# EAGLE design ImageProc2_ver_24d (EAGLE 5.11)
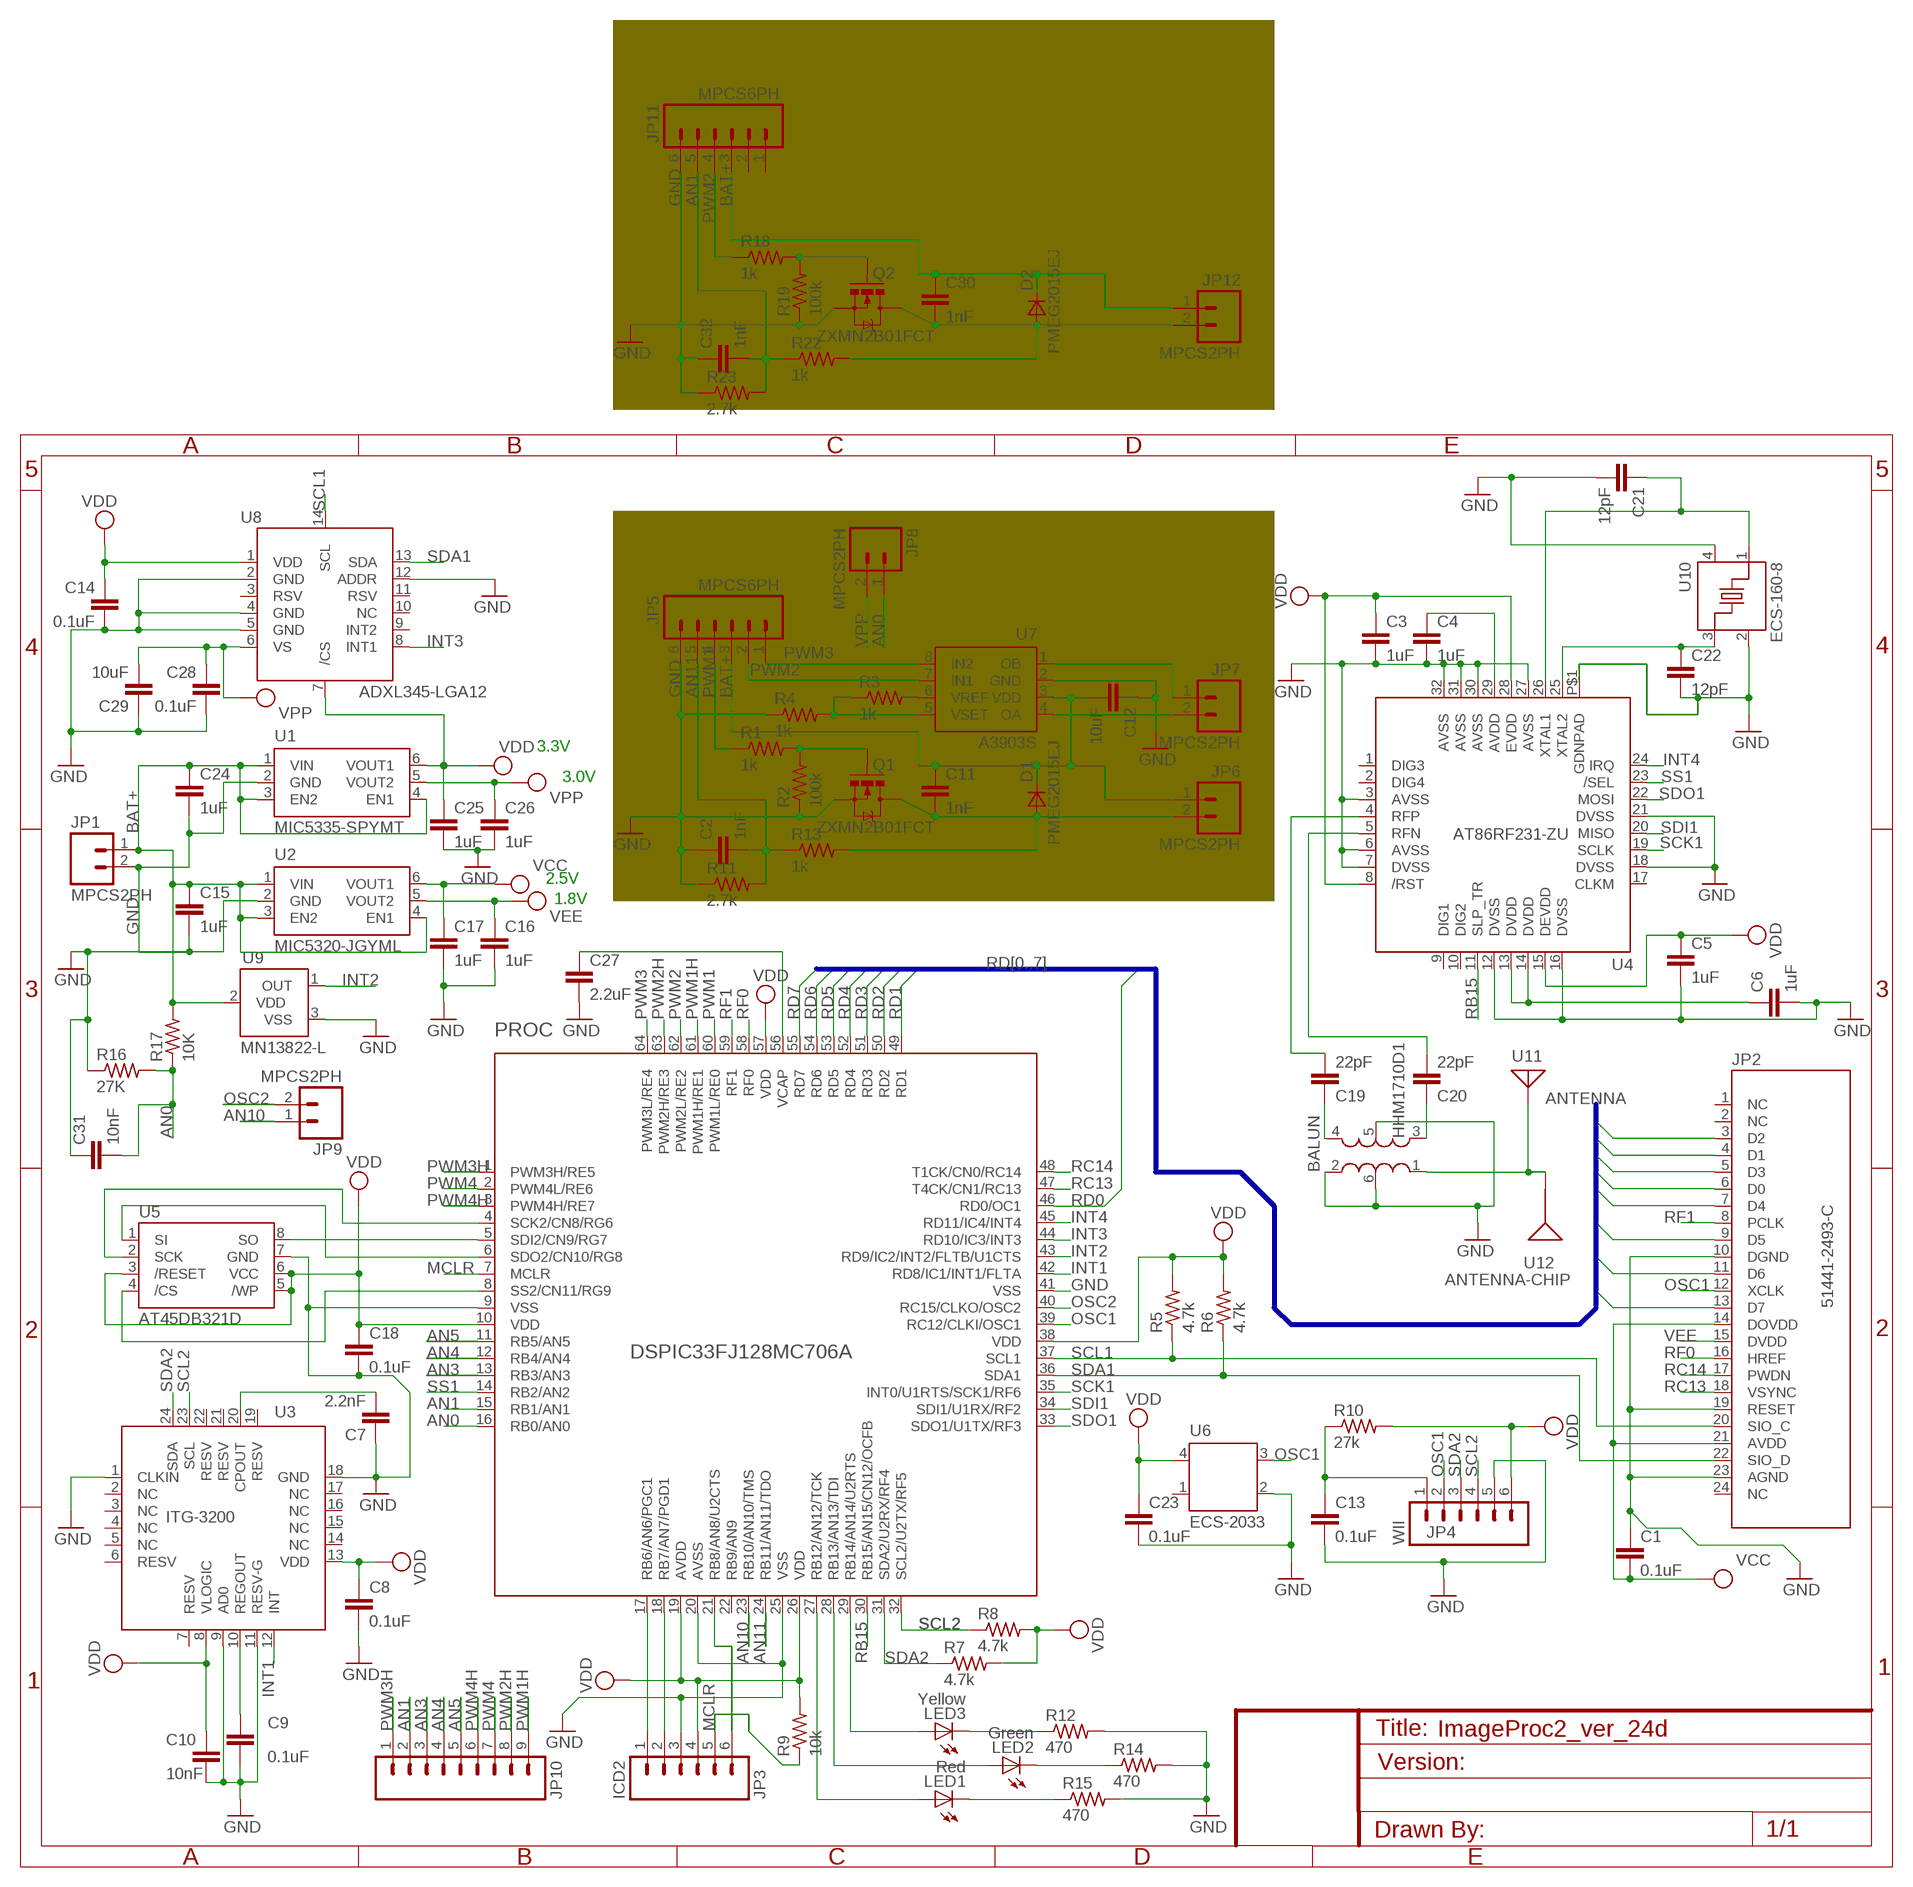
[diagram p0: schematic, sheet 1]

## Parts
BALUN  HHM1710D1  BALUNA  [BALUN]
C1  0.1uF  CAP0402-CAP  [0402-CAP]
C2  1nF  CAP0402-CAP  [0402-CAP]
C3  1uF  CAP0402-CAP  [0402-CAP]
C4  1uF  CAP0402-CAP  [0402-CAP]
C5  1uF  CAP0402-CAP  [0402-CAP]
C6  1uF  CAP0402-CAP  [0402-CAP]
C7  2.2nF  CAP0402-CAP  [0402-CAP]
C8  0.1uF  CAP0402-CAP  [0402-CAP]
C9  0.1uF  CAP0402-CAP  [0402-CAP]
C10  10nF  CAP0402-CAP  [0402-CAP]
C11  1nF  CAP0402-CAP  [0402-CAP]
C12  10uF  CAP0603-CAP  [0603-CAP]
C13  0.1uF  CAP0402-CAP  [0402-CAP]
C14  0.1uF  CAP0402-CAP  [0402-CAP]
C15  1uF  CAP0402-CAP  [0402-CAP]
C16  1uF  CAP0402-CAP  [0402-CAP]
C17  1uF  CAP0402-CAP  [0402-CAP]
C18  0.1uF  CAP0402-CAP  [0402-CAP]
C19  22pF  CAP0402-CAP  [0402-CAP]
C20  22pF  CAP0402-CAP  [0402-CAP]
C21  12pF  CAP0402-CAP  [0402-CAP]
C22  12pF  CAP0402-CAP  [0402-CAP]
C23  0.1uF  CAP0402-CAP  [0402-CAP]
C24  1uF  CAP0402-CAP  [0402-CAP]
C25  1uF  CAP0402-CAP  [0402-CAP]
C26  1uF  CAP0402-CAP  [0402-CAP]
C27  2.2uF  CAP0402-CAP  [0402-CAP]
C28  0.1uF  CAP0402-CAP  [0402-CAP]
C29  10uF  CAP0603-CAP  [0603-CAP]
C30  1nF  CAP0402-CAP  [0402-CAP]
C31  10nF  CAP0402-CAP  [0402-CAP]
C32  1nF  CAP0402-CAP  [0402-CAP]
D1  PMEG2015EJ  DSOD323  [SOD323]
D2  PMEG2015EJ  DSOD323  [SOD323]
JP1  MPCS2PH  [MOLEX-PICO_CLASP_S2P]
JP2  51441-2493-C  OV7660FSL_CON-24  [MOLEX-52740-2490]
JP3  ICD2  MPCS6PH  [MOLEX-PICO_CLASP_S6P]
JP4  WII  MPCS6PH  [MOLEX-PICO_CLASP_S6P]
JP5  MPCS6PH  [MOLEX-PICO_CLASP_S6P]
JP6  MPCS2PH  [MOLEX-PICO_CLASP_S2P]
JP7  MPCS2PH  [MOLEX-PICO_CLASP_S2P]
JP8  MPCS2PH  [MOLEX-PICO_CLASP_S2P]
JP9  MPCS2PH  [MOLEX-PICO_CLASP_S2P]
JP10  SOLDER_PADS_9P  [SOLDER_PADS_9P]
JP11  MPCS6PH  [MOLEX-PICO_CLASP_S6P]
JP12  MPCS2PH  [MOLEX-PICO_CLASP_S2P]
LED1  Red  LEDCHIP-LED0603  [CHIP-LED0603]
LED2  Green  LEDCHIP-LED0603  [CHIP-LED0603]
LED3  Yellow  LEDCHIP-LED0603  [CHIP-LED0603]
PROC  DSPIC33FJ128MC706A  DSPIC33FJ128MC706-I/PT  [TQFP64]
Q1  ZXMN2B01FCT  MOSFET-NCHANNELSMD  [SOT23-3]
Q2  ZXMN2B01FCT  MOSFET-NCHANNELSMD  [SOT23-3]
R1  1k  R-US_R0402  [R0402]
R2  100k  R-US_R0402  [R0402]
R3  1k  R-US_R0402  [R0402]
R4  1k  R-US_R0402  [R0402]
R5  4.7k  R-US_R0402  [R0402]
R6  4.7k  R-US_R0402  [R0402]
R7  4.7k  R-US_R0402  [R0402]
R8  4.7k  R-US_R0402  [R0402]
R9  10k  R-US_R0402  [R0402]
R10  27k  R-US_R0402  [R0402]
R11  2.7k  R-US_R0402  [R0402]
R12  470  R-US_R0402  [R0402]
R13  1k  R-US_R0402  [R0402]
R14  470  R-US_R0402  [R0402]
R15  470  R-US_R0402  [R0402]
R16  27K  R-US_R0402  [R0402]
R17  10K  R-US_R0402  [R0402]
R18  1k  R-US_R0402  [R0402]
R19  100k  R-US_R0402  [R0402]
R22  1k  R-US_R0402  [R0402]
R23  2.7k  R-US_R0402  [R0402]
U1  MIC5335-SPYMT  MIC5320-JGYML  [MLF-6]
U2  MIC5320-JGYML  [MLF-6]
U3  ITG-3200  ITG-3200-00  [QFN-24]
U4  AT86RF231-ZU  [QFN-32]
U5  AT45DB321D  [MLF(VDFN)-8]
U6  ECS-2033  OSCILLATORS  [OSCILLATOR-SMD]
U7  A3903S  [DFN-8]
U8  ADXL345-LGA12  ADXL345  [LGA14]
U9  MN13822-L  VOL_DETECTOR  [SOT-23-3]
U10  ECS-160-8  CRYSTALS  [CRYSTAL-SMD]
U11  ANTENNA  [ANTENNA_PAD]
U12  ANTENNA-CHIP  [ANTENNA-CHIP]

## Nets
AN0: C31.2 JP8.1 PROC.16(RB0/AN0) R16.2 R17.1
AN1: C32.2 JP10.2 JP11.5 PROC.15(RB1/AN1) R22.1 R23.2
AN3: JP10.3 PROC.13(RB3/AN3)
AN4: JP10.4 PROC.12(RB4/AN4)
AN5: JP10.5 PROC.11(RB5/AN5)
AN10: JP9.1 PROC.23(RB10/AN10/TMS)
AN11: C2.2 JP5.5 PROC.24(RB11/AN11/TDO) R11.2 R13.1
BAT+ [sup]: C11.1 C12.2 C15.1 C24.1 C30.1 D1.1(C) D2.1(C) JP1.1 JP5.3 JP6.1 JP11.3 JP12.1 R17.2 U1.1(VIN) U1.3(EN2) U1.4(EN1) U2.1(VIN) U2.3(EN2) U2.4(EN1) U7.3(VDD) U9.2(VDD)
GND [sup]: BALUN.2(RFGND) BALUN.5(GND) BALUN.6(NC) C1.1 C2.1 C3.2 C4.2 C5.2 C6.2 C7.1 C8.2 C9.2 C10.2 C12.1 C13.2 C14.2 C15.2 C16.2 C17.2 C18.2 C21.2 C22.2 C23.2 C24.2 C25.2 C26.2 C27.2 C28.2 C29.1 C31.1 C32.1 JP1.2 JP2.10(DGND) JP2.19(RESET) JP2.23(AGND) JP3.3 JP4.5 JP5.6 JP11.6 PROC.9(VSS) PROC.20(AVSS) PROC.25(VSS) PROC.41(VSS) Q1.2(S) Q2.2(S) R2.1 R4.1 R11.1 R12.2 R14.2 R15.2 R16.1 R19.1 R23.1 U1.2(GND) U2.2(GND) U3.1(CLKIN) U3.9(AD0) U3.11(RESV-G) U3.18(GND) U4.3(AVSS) U4.6(AVSS) U4.7(DVSS) U4.12(DVSS) U4.16(DVSS) U4.18(DVSS) U4.21(DVSS) U4.27(AVSS) U4.30(AVSS) U4.31(AVSS) U4.32(AVSS) U4.P$1(GDNPAD) U5.7(GND) U6.2(GND) U7.2(GND) U8.2(GND) U8.4(GND) U8.5(GND) U8.12(ADDR) U9.3(VSS) U10.2(GND) U10.4(GND)
INT1: PROC.42(RD8/IC1/INT1/FLTA) U3.12(INT)
INT2: PROC.43(RD9/IC2/INT2/FLTB/U1CTS) U9.1(OUT)
INT3: PROC.44(RD10/IC3/INT3) U8.8(INT1)
INT4: PROC.45(RD11/IC4/INT4) U4.24(IRQ)
MCLR: JP3.5 PROC.7(MCLR) R9.1
N$1: C27.1 PROC.56(VCAP)
N$2: PROC.6(SDO2/CN10/RG8) U5.1(SI)
N$3: LED3.C R12.1
N$4: Q2.1(G) R18.2 R19.2
N$6: LED3.A PROC.29(RB14/AN14/U2RTS)
N$7: LED2.C R14.1
N$8: LED1.C R15.1
N$9: LED2.A PROC.28(RB13/AN13/TDI)
N$11: LED1.A PROC.27(RB12/AN12/TCK)
N$14: Q1.1(G) R1.2 R2.2
N$15: C30.2 D2.2(A) JP12.2 Q2.3(D) R22.2
N$16: C11.2 D1.2(A) JP6.2 Q1.3(D) R13.2
N$19: JP7.1 U7.1(OB)
N$20: JP7.2 U7.4(OA)
N$21: JP3.1 PROC.17(RB6/AN6/PGC1)
N$23: C4.1 U4.29(AVDD)
N$24: JP3.2 PROC.18(RB7/AN7/PGD1)
N$25: R3.2 U7.6(VREF)
N$26: R3.1 R4.2 U7.5(VSET)
N$28: C6.1 U4.13(DVDD) U4.14(DVDD)
N$29: C7.2 U3.20(CPOUT)
N$32: C9.1 U3.10(REGOUT)
N$42: PROC.4(SCK2/CN8/RG6) U5.2(SCK)
N$43: BALUN.4(BAL4) C19.1
N$45: PROC.5(SDI2/CN9/RG7) U5.8(SO)
N$46: BALUN.3(BAL3) C20.1
N$47: C19.2 U4.4(RFP)
N$48: PROC.8(SS2/CN11/RG9) U5.4(/CS)
N$49: C20.2 U4.5(RFN)
N$50: C22.1 U4.25(XTAL2) U10.3(IN/OUT)
N$51: C21.1 U4.26(XTAL1) U10.1(IN/OUT)
N$52: BALUN.1(UNBAL) U11.P$1 U12.SIG(SIGNAL)
N$57: C13.1 JP4.1 R10.1
N$62: JP3.6 PROC.21(RB8/AN8/U2CTS)
OSC1: JP2.12(XCLK) JP4.2 PROC.39(RC12/CLKI/OSC1) U6.3(OUT)
OSC2: JP9.2 PROC.40(RC15/CLKO/OSC2)
PWM1: JP5.4 PROC.60(PWM1L/RE0) R1.1
PWM1H: JP10.9 PROC.61(PWM1H/RE1)
PWM2: JP5.2 JP11.4 PROC.62(PWM2L/RE2) R18.1 U7.7(IN1)
PWM2H: JP10.8 PROC.63(PWM2H/RE3)
PWM3: JP5.1 PROC.64(PWM3L/RE4) U7.8(IN2)
PWM3H: JP10.1 PROC.1(PWM3H/RE5)
PWM4: JP10.7 PROC.2(PWM4L/RE6)
PWM4H: JP10.6 PROC.3(PWM4H/RE7)
RB15: PROC.30(RB15/AN15/CN12/OCFB) U4.11(SLP_TR)
RC13: JP2.18(VSYNC) PROC.47(T4CK/CN1/RC13)
RC14: JP2.17(PWDN) PROC.48(T1CK/CN0/RC14)
RD0: JP2.6(D0) PROC.46(RD0/OC1)
RD1: JP2.4(D1) PROC.49(RD1)
RD2: JP2.3(D2) PROC.50(RD2)
RD3: JP2.5(D3) PROC.51(RD3)
RD4: JP2.7(D4) PROC.52(RD4)
RD5: JP2.9(D5) PROC.53(RD5)
RD6: JP2.11(D6) PROC.54(RD6)
RD7: JP2.13(D7) PROC.55(RD7)
RF0: JP2.16(HREF) PROC.58(RF0)
RF1: JP2.8(PCLK) PROC.59(RF1)
SCK1: PROC.35(INT0/U1RTS/SCK1/RF6) U4.19(SCLK)
SCL1: JP2.20(SIO_C) PROC.37(SCL1) R5.1 U8.14(SCL)
SCL2: JP4.4 PROC.32(SCL2/U2TX/RF5) R8.1 U3.23(SCL)
SDA1: JP2.22(SIO_D) PROC.36(SDA1) R6.1 U8.13(SDA)
SDA2: JP4.3 PROC.31(SDA2/U2RX/RF4) R7.1 U3.24(SDA)
SDI1: PROC.34(SDI1/U1RX/RF2) U4.20(MISO)
SDO1: PROC.33(SDO1/U1TX/RF3) U4.22(MOSI)
SS1: PROC.14(RB2/AN2) U4.23(/SEL)
VCC: C1.2 C17.1 JP2.14(DOVDD) JP2.21(AVDD) U2.6(VOUT1)
VDD: C3.1 C5.1 C8.1 C10.1 C14.1 C18.1 C23.1 C25.1 JP3.4 JP4.6 PROC.10(VDD) PROC.19(AVDD) PROC.26(VDD) PROC.38(VDD) PROC.57(VDD) R5.2 R6.2 R7.2 R8.2 R9.2 R10.2 U1.6(VOUT1) U3.8(VLOGIC) U3.13(VDD) U4.8(/RST) U4.15(DEVDD) U4.28(EVDD) U5.3(/RESET) U5.5(/WP) U5.6(VCC) U6.4(VDD) U8.1(VDD) U8.7(/CS)
VEE: C16.1 JP2.15(DVDD) U2.5(VOUT2)
VPP: C26.1 C28.1 C29.2 JP8.2 U1.5(VOUT2) U8.6(VS)
Unconnected: JP2.1(NC) JP2.2(NC) JP2.24(NC) JP11.1 JP11.2 PROC.22(RB9/AN9) U3.2(NC) U3.3(NC) U3.4(NC) U3.5(NC) U3.6(RESV) U3.7(RESV) U3.14(NC) U3.15(NC) U3.16(NC) U3.17(NC) U3.19(RESV) U3.21(RESV) U3.22(RESV) U4.1(DIG3) U4.2(DIG4) U4.9(DIG1) U4.10(DIG2) U4.17(CLKM) U6.1(NC) U8.3(RSV) U8.9(INT2) U8.10(NC) U8.11(RSV)

## Buses
RD[0..7]

## Notes on the sheet
- 3.3V
- 3.0V
- 2.5V
- 1.8V

## Library data of the parts
BALUN = stan:BALUN
C1-C32 = SparkFun:CAP: Capacitor Standard 0603 ceramic capacitor, and 0.1" leaded capacitor.
D1 D2 = zetex:D: DIODE; MPN: CDSOD323-T05C; OC_FARNELL: 1824860; OC_NEWARK: 79R6078
JP1 JP6-JP9 JP12 = stan:MPCS2P: Molex Pico-Clasp Single Row 2 POS
JP2 = stan:OV7660FSL_CON
JP3-JP5 JP11 = stan:MPCS6P: Molex Pico-Clasp Single Row 6 Pos
JP10 = stan:SOLDER_PADS_9P
LED1-LED3 = led:LED: LED OSRAM: - CHIPLED LG R971, LG N971, LY N971, LG Q971, LY Q971, LO R971, LY R971 LH N974, LH R974 LS Q976, LO Q976, LY Q976 LO Q996 - Hyper CHIPLED LW Q18S LB Q993, LB Q99A, LB R99A - SideLED LS A670, LO A670, LY A670, LG A670, LP A670 LB A673, LV A673, LT A673, LW A673 LH A674 LY A675 LS A676, LA A676, LO A676, LY A676, LW A676 LS A679, LY A679, LG A679 - Hyper Micro SIDELED® LS Y876, LA Y876, LO Y876, LY Y876 LT Y87S - SmartLED LW L88C, LW L88S LB L89C, LB L89S, LG L890 LS L89K, LO L89K, LY L89K LS L896, LA L896, LO L896, LY L896 - TOPLED LS T670, LO T670, LY T670, LG T670, LP T670 LSG T670, LSP T670, LSY T670, LOP T670, LYG T670 LG T671, LOG T671, LSG T671 LB T673, LV T673, LT T673, LW T673 LH T674 LS T676, LA T676, LO T676, LY T676, LB T676, LH T676, LSB T676, LW T676 LB T67C, LV T67C, LT T67C, LS T67K, LO T67K, LY T67K, LW E67C LS E67B, LA E67B, LO E67B, LY E67B, LB E67C, LV E67C, LT E67C LW T67C LS T679, LY T679, LG T679 LS T770, LO T770, LY T770, LG T770, LP T770 LB T773, LV T773, LT T773, LW T773 LH T774 LS E675, LA E675, LY E675, LS T675 LS T776, LA T776, LO T776, LY T776, LB T776 LHGB T686 LT T68C, LB T68C - Hyper Mini TOPLED® LB M676 - Mini TOPLED Santana® LG M470 LS M47K, LO M47K, LY M47K Source: http://www.osram.convergy.de LUXEON: - LUMILED® LXK2-PW12-R00, LXK2-PW12-S00, LXK2-PW14-U00, LXK2-PW14-V00 LXK2-PM12-R00, LXK2-PM12-S00, LXK2-PM14-U00 LXK2-PE12-Q00, LXK2-PE12-R00, LXK2-PE12-S00, LXK2-PE14-T00, LXK2-PE14-U00 LXK2-PB12-K00, LXK2-PB12-L00, LXK2-PB12-M00, LXK2-PB14-N00, LXK2-PB14-P00, LXK2-PB14-Q00 LXK2-PR12-L00, LXK2-PR12-M00, LXK2-PR14-Q00, LXK2-PR14-R00 LXK2-PD12-Q00, LXK2-PD12-R00, LXK2-PD12-S00 LXK2-PH12-R00, LXK2-PH12-S00 LXK2-PL12-P00, LXK2-PL12-Q00, LXK2-PL12-R00 Source: www.luxeon.com KINGBRIGHT: KA-3528ASYC Source: www.kingbright.com
PROC = stan:DSPIC33FJ128MC706: Microchip dsPIC33FJ128MC706
Q1 Q2 = SparkFun:MOSFET-NCHANNEL
R1-R19 R22 R23 = rcl:R-US_: RESISTOR, American symbol
U1 U2 = stan:MIC5320: MIC5320 High Performance Dual 150mA Voltage Regulator Package: NOT VERIFIED
U3 = stan:ITG-3200: Invensense 3-axis Gyroscope Package: NOT VERIFIED YET
U4 = stan:AT86RF231: Atmel 2.4GHz transceiver for Zigbee
U5 = stan:AT45DB: Atmel DataFlash AT45DB Series Package: NOT VERIFIED
U6 = stan:OSCILLATOR
U7 = stan:A3903: Allegro Low Voltage DC Motor Driver (A3903) Package: DFN-8
U8 = stan:ADXL345
U9 = stan:VOL_DETECTOR
U10 = stan:CRYSTAL
U11 = stan:ANTENNA
U12 = stan:ANTENNA-CHIP

## Net classes
1 sup: width 0.254 mm

## Board
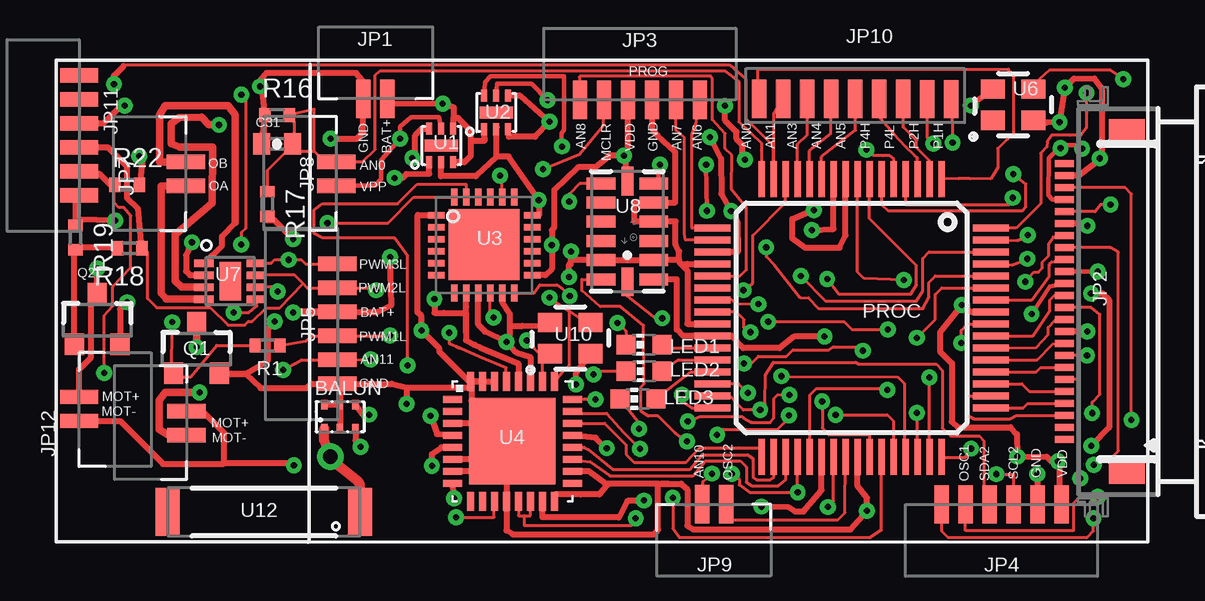
[diagram p1: board, top side]
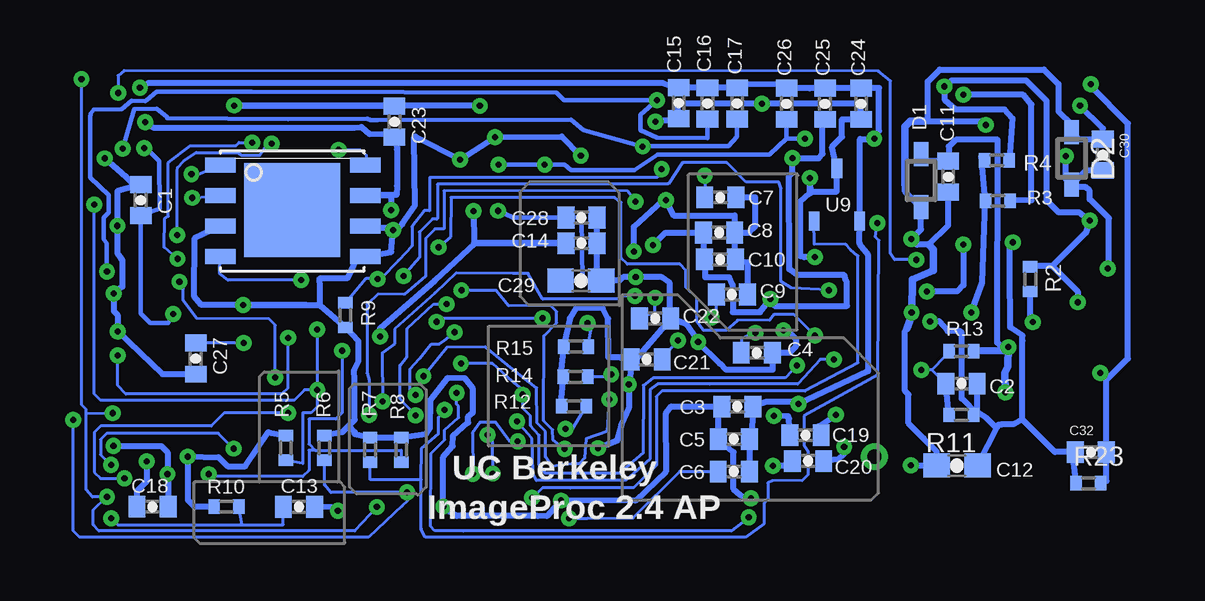
[diagram p2: board, bottom side, seen from below]

No outline drawn. Coordinates in mm, seen from the top.
Copper layers (1*16): Top 0.035mm / dielectric 1.5mm / Bottom 0.035mm
Design rules "default *": minimum track width 5mil, minimum drill 10mil, track to track 5mil, track to pad 5mil, pad to pad 5mil, via to via 5mil, smd to smd 5mil, copper to edge 5mil, drill to drill 5mil, minimum pad ring 10mil, minimum via ring 8mil, stop-mask expansion 4mil, vias tented up to drill 27mil, thermal gap 10mil

### Footprints (pad centres in the part's own frame; a part is rotated, then mirrored left to right if it is on the bottom)
BALUN = smd 0.27 x 0.4: 1 -0.7,-0.5; 2 -0.05,-0.5; 3 0.6,-0.5; 4 0.6,0.5; 5 -0.05,0.5; 6 -0.7,0.5
0402-CAP = smd 0.7 x 0.9: 1 -0.65,0; 2 0.65,0
0603-CAP = smd 1.1 x 1: 1 -0.85,0; 2 0.85,0
SOD323 = smd 1 x 0.6: 1 -1.1,0; 2 1.1,0
MOLEX-PICO_CLASP_S2P = smd 0.6 x 1.6: 1 -0.5,1; 2 0.5,1
MOLEX-52740-2490 = smd 0.3 x 0.8: 1 -5.75,2.5; 2 -5.25,2.5; 3 -4.75,2.5; 4 -4.25,2.5; 5 -3.75,2.5; 6 -3.25,2.5; 7 -2.75,2.5; 8 -2.25,2.5; 9 -1.75,2.5; 10 -1.25,2.5; 11 -0.75,2.5; 12 -0.25,2.5; 13 0.25,2.5; 14 0.75,2.5; 15 1.25,2.5; 16 1.75,2.5; 17 2.25,2.5; 18 2.75,2.5; 19 3.25,2.5; 20 3.75,2.5; 21 4.25,2.5; 22 4.75,2.5; 23 5.25,2.5; 24 5.75,2.5 | smd 0.85 x 1.5: P$1 -7.18,-0.1; P$2 7.18,-0.1
MOLEX-PICO_CLASP_S6P = smd 0.6 x 1.6: 1 -2.5,1; 2 -1.5,1; 3 -0.5,1; 4 0.5,1; 5 1.5,1; 6 2.5,1
SOLDER_PADS_9P = smd 0.6 x 1.6: 1 -2.5,0.365; 2 -1.5,0.365; 3 -0.5,0.365; 4 0.5,0.365; 5 1.5,0.365; 6 2.5,0.365; 7 3.5,0.365; 8 4.5,0.35; 9 5.5,0.35
CHIP-LED0603 = smd 0.8 x 0.8: A 0,-0.75; C 0,0.75
TQFP64 = smd 1.5 x 0.28: 1 -5.8,3.75; 2 -5.8,3.25; 3 -5.8,2.75; 4 -5.8,2.25; 5 -5.8,1.75; 6 -5.8,1.25; 7 -5.8,0.75; 8 -5.8,0.25; 9 -5.8,-0.25; 10 -5.8,-0.75; 11 -5.8,-1.25; 12 -5.8,-1.75; 13 -5.8,-2.25; 14 -5.8,-2.75; 15 -5.8,-3.25; 16 -5.8,-3.75; 33 5.8,-3.75; 34 5.8,-3.25; 35 5.8,-2.75; 36 5.8,-2.25; 37 5.8,-1.75; 38 5.8,-1.25; 39 5.8,-0.75; 40 5.8,-0.25; 41 5.8,0.25; 42 5.8,0.75; 43 5.8,1.25; 44 5.8,1.75; 45 5.8,2.25; 46 5.8,2.75; 47 5.8,3.25; 48 5.8,3.75 | smd 0.28 x 1.5: 17 -3.75,-5.8; 18 -3.25,-5.8; 19 -2.75,-5.8; 20 -2.25,-5.8; 21 -1.75,-5.8; 22 -1.25,-5.8; 23 -0.75,-5.8; 24 -0.25,-5.8; 25 0.25,-5.8; 26 0.75,-5.8; 27 1.25,-5.8; 28 1.75,-5.8; 29 2.25,-5.8; 30 2.75,-5.8; 31 3.25,-5.8; 32 3.75,-5.8; 49 3.75,5.8; 50 3.25,5.8; 51 2.75,5.8; 52 2.25,5.8; 53 1.75,5.8; 54 1.25,5.8; 55 0.75,5.8; 56 0.25,5.8; 57 -0.25,5.8; 58 -0.75,5.8; 59 -1.25,5.8; 60 -1.75,5.8; 61 -2.25,5.8; 62 -2.75,5.8; 63 -3.25,5.8; 64 -3.75,5.8
SOT23-3 = smd 0.8 x 0.9: 1 -0.95,-1; 2 0.95,-1; 3 0,1.1
R0402 = smd 0.475 x 0.6: 1 -0.512,0; 2 0.512,0
MLF-6 = smd 0.25 x 0.5: 1 -0.5,-0.7; 2 0,-0.7; 3 0.5,-0.7; 4 0.5,0.7; 5 0,0.7; 6 -0.5,0.7 | smd 1.4 x 0.5: P$1 0,0
QFN-24 = smd 0.7 x 0.275: 1 -2,1.25; 2 -2,0.75; 3 -2,0.25; 4 -2,-0.25; 5 -2,-0.75; 6 -2,-1.25; 13 2,-1.25; 14 2,-0.75; 15 2,-0.25; 16 2,0.25; 17 2,0.75; 18 2,1.25 | smd 0.275 x 0.7: 7 -1.25,-2; 8 -0.75,-2; 9 -0.25,-2; 10 0.25,-2; 11 0.75,-2; 12 1.25,-2; 19 1.25,2; 20 0.75,2; 21 0.25,2; 22 -0.25,2; 23 -0.75,2; 24 -1.25,2 | smd 2.95 x 2.95: 25 -0.01,0.03
QFN-32 = smd 0.8 x 0.3: 1 -2.5,1.75; 2 -2.5,1.25; 3 -2.5,0.75; 4 -2.5,0.25; 5 -2.5,-0.25; 6 -2.5,-0.75; 7 -2.5,-1.25; 8 -2.5,-1.75; 17 2.5,-1.75; 18 2.5,-1.25; 19 2.5,-0.75; 20 2.5,-0.25; 21 2.5,0.25; 22 2.5,0.75; 23 2.5,1.25; 24 2.5,1.75 | smd 0.3 x 0.8: 9 -1.75,-2.5; 10 -1.25,-2.5; 11 -0.75,-2.5; 12 -0.25,-2.5; 13 0.25,-2.5; 14 0.75,-2.5; 15 1.25,-2.5; 16 1.75,-2.5; 25 1.75,2.5; 26 1.25,2.5; 27 0.75,2.5; 28 0.25,2.5; 29 -0.25,2.5; 30 -0.75,2.5; 31 -1.25,2.5; 32 -1.75,2.5 | smd 3.6 x 3.6: P$1 0,0.001
MLF(VDFN)-8 = smd 1.27 x 0.635: 1 0,4.31; 2 0,3.04; 3 0,1.77; 4 0,0.5; 5 6.05,0.5; 6 6.05,1.77; 7 6.05,3.04; 8 6.05,4.31 | smd 4 x 3.9: P$1 2.991,2.44
OSCILLATOR-SMD = smd 1 x 0.8: 1 -0.85,-0.65; 2 0.85,-0.65; 3 0.85,0.65; 4 -0.85,0.65
DFN-8 = smd 0.3 x 0.83: 1 -0.75,-1.1; 2 -0.25,-1.1; 3 0.25,-1.1; 4 0.75,-1.1; 5 0.75,1.1; 6 0.25,1.1; 7 -0.25,1.1; 8 -0.75,1.1 | smd 1.6 x 0.9: 9 0,0
LGA14 = smd 0.5 x 1.2: 1 2,1.1; 2 1.2,1.1; 3 0.4,1.1; 4 -0.4,1.1; 5 -1.2,1.1; 6 -2,1.1; 8 -2,-1.1; 9 -1.2,-1.1; 10 -0.4,-1.1; 11 0.4,-1.1; 12 1.2,-1.1; 13 2,-1.1 | smd 1.2 x 0.5: 7 -2.1,0; 14 2.1,0
SOT-23-3 = smd 0.45 x 0.8: 1 0.2,0.4; 2 1.15,2.6; 3 2.1,0.4
CRYSTAL-SMD = smd 1 x 0.8: 1 -0.85,-0.65; 2 0.85,-0.65; 3 0.85,0.65; 4 -0.85,0.65
ANTENNA_PAD = drill 0.6 round: P$1 0,0
ANTENNA-CHIP = smd 1 x 2: NC 4,0; SIG -4,0

### Placement (x,y rotation side)
BALUN  11.92,5.28 0 top
C1  42.05,14.31 270 bottom
C2  7.84,6.66 180 bottom
C3  17.18,5.7 0 bottom
C4  16.37,7.94 0 bottom
C5  17.33,4.35 0 bottom
C6  17.33,2.99 0 bottom
C7  17.89,14.42 180 bottom
C8  17.95,12.96 0 bottom
C9  17.41,10.37 0 bottom
C10  17.91,11.83 0 bottom
C11  8.4,15.29 90 bottom
C12  8.03,3.25 180 bottom
C13  35.46,1.52 0 bottom
C14  23.68,12.51 0 bottom
C15  19.63,18.35 90 bottom
C16  18.43,18.34 90 bottom
C17  17.19,18.34 90 bottom
C18  41.56,1.53 0 bottom
C19  14.34,4.51 180 bottom
C20  14.23,3.43 180 bottom
C21  20.97,7.67 180 bottom
C22  20.61,9.37 0 bottom
C23  31.48,17.58 270 bottom
C24  12.03,18.33 90 bottom
C25  13.53,18.32 90 bottom
C26  15.13,18.33 90 bottom
C27  39.76,7.7 270 bottom
C28  23.68,13.58 0 bottom
C29  23.71,10.95 180 bottom
C30  1.95,16.2 270 bottom
C31  9.25,16.65 0 top
C32  2.45,3.8 0 bottom
D1  9.53,15.13 90 bottom
D2  3.25,16.05 270 bottom
JP1  13.34,19.53 180 top
JP2  44.57,10.08 90 top
JP3  24.38,19.49 180 top
JP4  39.44,0.62 0 top
JP5  10.77,9.15 270 top
JP6  4.47,5.01 270 top
JP7  4.45,15.4 270 top
JP8  10.72,15.41 270 top
JP9  27.48,0.63 0 top
JP10  31.85,18.17 0 top
JP11  0,17 270 top
JP12  2,5.6 90 top
LED1  24.54,8.28 90 top
LED2  24.55,7.18 90 top
LED3  24.29,6.02 90 top
PROC  33.2,9.39 270 top
Q1  5.89,8.09 0 top
Q2  1.75,9.3 0 top
R1  8.85,8.25 180 top
R2  4.98,11.01 270 bottom
R3  6.33,14.28 0 bottom
R4  6.37,15.97 180 bottom
R5  36.01,3.98 90 bottom
R6  34.4,3.98 90 bottom
R7  32.49,3.89 90 bottom
R8  31.19,3.89 90 bottom
R9  33.52,9.51 270 bottom
R10  38.48,1.53 180 bottom
R11  7.85,5.35 180 bottom
R12  24,5.71 180 bottom
R13  7.85,8.01 0 bottom
R14  23.93,6.94 180 bottom
R15  23.92,8.2 180 bottom
R16  9.25,17.85 0 top
R17  8.85,14.15 270 top
R18  3.1,12.3 180 top
R19  0.85,12.75 270 top
R22  3,14.95 0 top
R23  2.55,2.5 0 bottom
U1  16.09,16.58 0 top
U2  18.38,17.96 0 top
U3  17.88,12.43 0 top
U4  19.06,4.25 0 top
U5  38.73,11.46 0 bottom
U6  39.93,18.28 0 top
U7  7.3,10.93 270 top
U8  23.85,13.01 270 top
U9  14.19,13.03 0 bottom
U10  21.47,8.56 0 top
U11  11.47,3.61 0 top
U12  8.7,1.3 180 top

### Tracks (layer width: path | path; a pad name or v marks a point on that pad's centre or on a via)
AN0
  Top 0.127: PROC.16 29.43,16.37 29.43,16.69 28.5,17.58 28.5,19.25 27.9,19.7 13.55,19.7 13.34,19.52 13.34,16.42 12.81,15.91 JP8.1 11.24,15.91 10.8,16.35 | 10.8,16.35 10.8,18.1 R16.2 9.96,17.57 9.96,16.3 C31.2 | 10.8,16.35 10.15,16.35 9.9,16.6 8.85,15.55 R17.1
AN1  (via drill 0.25 pad 0.66)
  Top 0.127: JP10.2 29.96,17.91 PROC.15 29.95,16.55 28.8,17.7 28.8,19.35 28.1,19.95 2.85,19.95 2.85,19.9 | v2.05,7.1 2.05,9.5 2.4,9.9 2.4,10.7 3.15,11.5 3.15,13.65 2.85,14 2.65,14 2.45,14.2 2.45,14.85 R22.1
  Top 0.254: R22.1 2.3,14.95 1.85,15.4 1.1,15.4 JP11.5 | v2.45,19.15 2.45,19.5 2.85,19.9
  Bottom 0.254: R23.2 1.8,2.6 C32.2 1.8,6.8 | 1.8,6.8 1.8,6.85 v2.05,7.1 | v2.45,19.15 2.45,19.05 0.9,17.5 0.9,7.7 1.8,6.8
AN3
  Top 0.127: PROC.13 30.95,16.64 31.36,17.03 JP10.3
AN4
  Top 0.127: PROC.12 31.44,16.36 32.33,17.08 JP10.4
AN5
  Top 0.127: PROC.11 31.95,16.12 33.36,17.23 JP10.5
AN10  (via drill 0.25 pad 0.66)
  Top 0.127: PROC.23 28.19,10.16 28.41,9.96 v29.31,9.97 | v30.59,5.33 30.36,5 30.11,4.75 27.84,4.75 v27.59,4.52 | JP9.1 26.99,2.06 26.99,2.14 27,2.29 27,2.56 v27.38,2.9
  Bottom 0.127: v29.31,9.97 29.84,9.97 30.95,8.95 30.96,7.78 31.25,7.42 31.25,6.02 v30.59,5.33 | v27.38,2.9 27.38,4.18 27.39,4.39 v27.59,4.52
AN11  (via drill 0.25 pad 0.66)
  Top 0.127: v9.51,7.23 9.97,7.48 10.27,7.65 | 10.27,7.65 | 10.27,7.65 JP5.5 v13.15,7.66 | v26.37,5.08 26.88,5.29 28.61,5.28 28.7,5.23 29.03,5.04 29.8,5.03 29.96,5.22 29.96,6.03 30.12,6.2 v30.6,6.18 | PROC.24 28.37,9.65 28.41,9.65 28.71,9.32 28.71,8.98 v28.98,8.8
  Bottom 0.127: v13.15,7.66 13.72,7.67 14.66,6.64 18.34,6.64 20.51,6.64 20.82,6.41 20.83,3.51 21.85,2.62 25.57,2.62 25.7,2.91 25.75,4.37 v26.37,5.08 | v28.98,8.8 29.21,8.6 29.38,8.46 29.6,8.3 29.94,8.3 30.43,7.71 30.82,7.28 30.82,6.36 v30.6,6.18 | 9.09,7.23 v9.51,7.23 | 8.5,6.65 9.09,7.23 | R13.1 8.5,7.82 9.09,7.23
  Bottom 0.254: C2.2 8.5,6.65 R11.2
BAT+  (via drill 0.25 pad 0.66)
  Top 0.254: U2.4 19.39,18.66 v20.6,17.59 20.01,16.95 18.91,16.95 U2.3 | 9.94,9.65 9.94,9.67 10.03,9.65 v9.92,9.63 | 17.32,16.8 17.91,16.8 U2.1 | 17.32,16.8 17.32,16.15 17.05,15.88 U1.3 | JP1.1 13.94,18.44 13.93,18.32 v16.16,18.33 16.32,18.32 16.62,18.18 16.62,17.74 16.8,17.73 | 16.8,17.73 16.59,17.73 U1.4 | 17.32,16.8 17.32,17.21 16.8,17.73 | v14.15,15.23 14.47,15.23 14.64,15.4 15.59,15.4 U1.1 | 5.2,16.53 5.21,16.52 | JP5.3 13.44,9.65 14.01,9.93 v13.95,11.94 | JP12.1 2.7,5.1 4.5,3.3 7,3.3 7.05,3.35 | v2.9,18.25 2.75,18.25 2,17.5 JP11.3 | R17.2 8.85,13.46 9.15,13.46 v9.93,12.68 | 5.07,5.51 6.14,5.51 7.05,4.6 7.05,3.35 | 7.05,3.35 9.84,3.35 v9.95,3.25
  Top 0.305: 9.94,9.65 JP5.3 | v6.83,17.45 6.4,17.46 6.1,17.77 5.17,17.76 4.84,17.51 4.84,16.67 5.2,16.53 | 5.21,16.52 6.56,16.52 6.55,14.2 5,12.86 5,10.94 5.27,10.68 U7.3 | 5.07,5.51 JP6.1
  Bottom 0.254: 14.15,15.04 14.14,14.66 13.04,14.66 U9.2 13.23,16.53 12.82,16.95 12.82,17.68 C24.1 12.03,18.32 16.14,18.32 16.18,18.32 v16.16,18.33 19.71,18.33 C15.1 19.71,17.62 20.56,17.62 v20.6,17.59 | v13.95,11.94 14.4,11.93 14.55,11.97 14.55,14.25 14.15,14.6 14.15,15.04 | 9.99,9.3 9.9,9.65 | 9.9,9.65 9.89,9.63 v9.91,9.62 9.94,9.62 v9.92,9.63 | 14.15,15.04 v14.15,15.23 | 9.9,10.97 9.89,11 | 9.9,9.65 9.91,9.66 | v2.9,18.25 1.95,17.3 C30.1 2.95,16.85 D2.1 3.25,17.45 3.8,18 3.8,19.15 4.4,19.75 8.75,19.75 9.25,19.25 9.25,17.71 9.35,17.61 7,17.61 6.85,17.45 v6.83,17.45 | 10.2,14.95 10.2,14.67 9.53,14 9.53,13.08 v9.93,12.68 9.69,12.45 9.2,12.45 8.4,13.25 C11.1 | 9.43,4.38 9.43,4.36 | 9.43,4.38 10.05,5 10.05,6.2 10.2,6.35 10.2,8.85 10.1,8.95 10.1,9 | 9.43,4.38 8.88,3.83 C12.2 v9.95,3.25
  Bottom 0.305: 9.99,9.3 10.1,9 10.12,8.96 | 9.53,14 D1.1 | 9.2,12.45 9.01,12.26 9.02,11.38 9.89,11 | 9.91,9.66 9.9,10.97 | 10.2,14.95 10.2,17.37 9.97,17.61 9.35,17.61
GND  (via drill 0.25, 0.25 pad 0.66)
  Top 0.254: BALUN.5 BALUN.2 | BALUN.5 BALUN.6 | JP5.6 14.04,6.65 14.64,6.5 | 43.62,16.35 43.62,18.96 43.32,19.38 42.48,19.38 v42.09,18.99 v41.87,17.56 41.29,17.53 41.01,17.53 U6.2 | 43.62,16.35 43.62,16.07 42.68,15.33 JP2.23 | 25.13,2.48 25.13,0.57 24.98,0.38 19.05,0.38 19.08,0.39 18.81,0.53 18.81,1.58 | 25.13,2.48 25.55,2.48 25.26,2.48 26.1,2.48 26.11,2.46 26.36,2.24 26.36,0.73 26.6,0.57 33.15,0.57 v33.84,1.36 33.84,1.89 33.45,2.38 PROC.41 | BALUN.5 11.85,6.62 11.8,6.62 JP5.6 | 18.41,16.13 18.9,16.13 v20.16,14.31 20.16,13.67 U3.18 | U3.1 15.12,13.69 15.1,9.63 15.27,9.49 v15.27,8.87 16.02,8.12 | PROC.25 26.36,9.14 26.36,11.38 26.1,11.64 | v43.18,10.41 43.65,10.41 43.93,10.14 43.93,4.83 v43.19,4.05 | JP5.6 10.69,6.65 10.46,6.47 8.56,6.47 7.94,7.06 7.17,7.06 7.07,6.96 Q1.2 7.12,7.07 7.96,7.07 8.85,7.59 8.86,8.77 8.86,8.91 v9.15,9.25 | 23.84,2.48 23.04,2.48 22.68,2.03 21.91,2.04 20.83,2.04 U4.16 | 16.02,8.12 | U4.31 17.25,6.75 16.02,7.98 16.02,8.12 | JP3.3 24.91,17.27 25.12,17 25.86,16.32 25.86,14.21 U8.5 24.15,14.21 24.15,13.41 U8.4 25.86,13.42 25.86,12.44 26,12.17 26,11.82 | v11.48,16.87 12.57,16.87 12.84,17.13 JP1.2 12.84,18.69 12.8,18.77 12.8,19.3 12.55,19.61 8.81,19.61 8.55,19.3 v8.55,19.05 8.6,19 R16.1 | v18.82,8.4 18.88,8.46 18.97,8.56 18.96,9.07 | v18.82,8.4 17.92,8.83 17.63,9.11 U3.9 | U4.32 U4.31 | v43.03,13.24 42.86,13.32 42.6,13.33 JP2.19 | U4.32 17.31,6.5 15.09,6.5 14.64,6.5 | U4.32 17.35,6.71 17.35,5.95 17.95,5.35 | 26,11.82 26,11.73 26.1,11.64 | U4.31 18.21,6.75 U4.30 | 26,11.82 25.45,11.82 25,11.86 U8.2 U8.12 22.76,11.83 21.57,11.83 v21.5,12.17 21.5,11.63 21.42,11.63 v21.42,11.1
  Top 0.254: 18.96,9.07 19.48,9.07 20.23,9.08 U10.4 | 14.64,6.5 v14.64,5.82 | 23.84,2.48 22.96,2.48 22.25,3 22.23,3 U4.18 | v18.82,8.4 19.22,7.96 19.81,7.76 U4.27 | v21.71,6.63 21.7,7.08 21.86,7.3 U10.2 | 18.96,9.07 18.96,9.56 18.96,9.57 18.64,10.04 U3.11 | 18.41,16.13 17.55,15.32 17.53,15.3 16.08,15.3 U1.2 | 18.41,16.13 18.41,17.35 18.41,17.36 U2.2 | 18.81,1.58 U4.12 | v40.94,2.88 JP4.5 | 26.1,11.64 26.35,11.64 PROC.20 | v43.02,8.83 42.93,8.83 JP2.10 | v22.99,3.96 22.52,4.4 U4.21 | 25.13,2.48 24.75,2.48 24.36,2.48 23.84,2.48 | v31.62,13.89 30.81,13.54 30.72,13.52 30.72,12.72 31.26,12.32 32.69,12.32 32.95,12.84 PROC.9 | U4.31 17.82,6.92 17.81,6.92 | 17.81,6.92 | 17.81,6.92 U4.31 | 43.62,16.35 v43.55,16.05 | U4.P$1 19.05,4.25 17.95,5.35 | U4.3 17.6,5 17.95,5.35 | U4.7 18.1,3 18.15,3.05 18.15,3.34 18.31,3.5 | 18.31,3.5 U4.6 | U4.P$1 18.31,3.5 | 18.81,1.58 18.81,4 U4.P$1 | JP11.6 0.85,14.35 R19.1 0.95,13.5 v2.5,13.45 | Q2.2 2.7,9.75 v3,10.05 | U7.2 5.62,11.18 5.45,11.35 5.45,12 v5.7,12.55 | R16.1 8.6,16.7 | C31.1 8.69,16.3 8.69,17.57 R16.1
  Bottom 0.254: 16.68,4.39 16.71,4.39 | 16.68,4.39 C5.2 16.59,4.31 C3.2 15.97,5.9 14.91,5.9 v14.64,5.82 11.73,7.18 11.73,12.01 12.07,12.46 12.1,12.53 U9.3 12.07,16.86 11.48,16.85 v11.48,16.87 11.28,17.2 11.28,18.98 C24.2 C25.2 14.17,18.97 14.18,18.98 C26.2 15.25,19.16 15.46,19.14 16.95,19.13 C17.2 C16.2 19.68,18.99 19.7,19 | 22.56,7.77 22.57,9.36 22.8,9.81 23.91,9.81 24.16,9.39 R15.2 24.57,7.03 R14.2 24.55,5.83 24.45,5.83 R12.2 | 22.56,7.77 22.07,7.76 C21.2 21.62,7.28 v21.71,6.63 21.71,5.64 22.02,4.95 22.2,4.27 v22.99,3.96 | 6.34,4.87 C12.1 | 6.34,4.87 6.29,4.95 6.17,4.96 5.67,4.96 5.31,5.16 | 5.31,5.16 5.3,8.45 | 5.3,8.45 5.3,8.65 5.81,9.01 5.83,11.4 5.83,11.46 5.83,12.33 v5.7,12.55 | v42.09,18.99 41.73,19.19 20.26,19.18 19.85,19 C15.2 19.7,19 | C27.2 41.15,7.05 v43.02,8.83 43.02,9.52 43.18,9.69 v43.18,10.41 42.83,10.7 42.82,11.8 42.87,11.87 43.02,12.1 v43.03,13.24 43.03,14.68 C1.1 42.35,14.96 42.68,15.29 v43.55,16.05 | C22.2 20.08,9.31 20,9.39 20,10.85 20.34,11.1 v21.42,11.1 21.95,11.1 22.11,10.95 C29.1 22.99,10.95 23.03,10.99 C14.2 23.03,13.38 22.98,13.42 C28.2 | C8.2 17.3,13.67 19.84,13.67 v20.16,14.31 20.3,14.26 21.5,13.19 v21.5,12.17 | 16.68,4.39 C6.2 | C22.2 19.29,9.12 18.89,8.56 18.69,8.53 18.65,8.53 v18.82,8.4 17.92,7.5 | 41.2,4.05 40.94,3.79 v40.94,2.88 40.91,2.86 | 41.2,4.05 | v43.19,4.05 41.2,4.05 | C22.2 21.36,7.73 22.56,7.77 | 17.92,7.5 17.66,7.24 15.72,7.24 C4.2 15,7.94 14.74,8.2 14.74,8.53 15.07,8.86 v15.27,8.87 | 17.92,7.5 | C9.2 16.76,11.71 C10.2 17.27,11.73 17.3,11.76 C8.2 | v41.87,17.56 41.51,17.33 33.15,17.33 32.86,17.36 32.52,17.07 31.85,17.08 C23.2 31.4,16.79 31.37,16.43 31.37,14.91
  Bottom 0.254: 31.37,14.91 31.39,14.52 32.71,14.52 U5.7 31.61,14.52 31.62,14.09 v31.62,13.89 | 31.37,14.91 | C8.2 16.7,12.96 16.44,13.22 16.44,14.42 C7.1 | 40.91,2.86 | 40.91,2.86 C18.2 | 19.7,19 | v33.84,1.36 34.07,1.51 C13.2 | R11.1 7.2,5.4 7.84,6.04 7.84,8.79 7.93,8.85 8.42,8.85 8.77,9.25 v9.15,9.25 | 6.34,4.87 6.45,4.87 6.8,5.22 7.14,5.42 7.2,5.37 R11.1 | R23.1 3.2,3.7 C32.1 3.95,3.8 5.31,5.16 | 5.3,8.45 | C2.1 7.19,5.36 R11.1 | 4.05,11.55 2.65,12.95 v2.5,13.45 2.95,13.8 3.8,13.8 4.3,14.3 4.3,18.45 5.15,19.3 8.25,19.3 8.55,19 | 4.05,11.55 4.87,11.55 R2.1 | v3,10.05 3,10.5 4.05,11.55 | R4.1 5.72,17.72 6.05,18.1 8.1,18.1 8.55,18.5 8.55,19 | v8.55,19.05 8.55,19
INT1  (via drill 0.25 pad 0.66)
  Top 0.127: v31.97,5.92 31.97,4.8 32.23,4.54 33.95,4.54 PROC.42 | v21.45,10.31 21.14,10.61 20.91,10.77 20.2,10.77 19.96,10.43 U3.12
  Bottom 0.127: v21.45,10.31 22.01,10.29 22.14,10.19 25.3,10.18 25.91,11.26 26.54,11.26 28.91,11.27 29.79,10.44 31.47,8.93 31.48,8.32 31.98,7.93 v31.97,5.92
INT2  (via drill 0.25 pad 0.66)
  Top 0.127: v25.74,1.89 25.74,0.63 26.02,0.24 33.97,0.24 34.45,0.55 PROC.43
  Bottom 0.127: v25.74,1.89 25.3,2.31 24.16,2.31 21.51,2.32 20.55,3.25 20.56,6.12 20.33,6.35 14.36,6.35 12.15,7.53 12.15,11.98 12.47,12.24 12.63,12.44 12.68,12.47 13.97,12.46 U9.1
INT3  (via drill 0.25 pad 0.66)
  Top 0.127: v32.53,5.36 34.68,5.36 34.95,5.09 PROC.44 | v21.43,14.25 21.43,14.57 21.86,15 U8.8
  Bottom 0.127: v21.43,14.25 21.77,14.7 29.42,14.71 29.42,13.1 29.79,13.1 30.18,12.71 30.18,11.14 31.08,10.38 32.16,10.39 32.62,9.96 32.62,7.09 32.53,6.81 v32.53,5.36
INT4  (via drill 0.25 pad 0.66)
  Top 0.127: v22.52,6 22.11,6 U4.24 | v30.27,6.96 35.12,6.93 35.4,6.66 35.4,3.59 PROC.45
  Bottom 0.127: v30.27,6.96 29.29,8.17 27.69,8.19 26.55,7.25 25.55,6.49 25.54,5.03 25.18,4.66 25.18,3.59 24.91,3.21 24.08,3.31 23.78,3.32 23.55,3.55 23.55,3.57 23.49,4.36 22.59,4.67 v22.52,6
MCLR  (via drill 0.25 pad 0.66)
  Top 0.127: v32.18,11.02 32.67,10.39 35.67,10.39 35.91,10.77 35.91,11.57 33.95,13.53 PROC.7 | v20.34,15.61 21.87,16.22 22.87,17.43 JP3.5
  Bottom 0.127: R9.1 32.67,11.04 32.65,11.03 32.19,11.04 v32.18,11.02 32.05,11.03 31.31,11.79 30.75,12.4 30.75,13.21 30.23,13.88 30,13.88 30.02,13.86 30.01,15.26 20.55,15.26 20.34,15.42 v20.34,15.61
N$1  (via drill 0.25 pad 0.66)
  Top 0.127: v37.77,8.35 37.77,8.88 38.03,9.14 PROC.56
  Bottom 0.127: v37.77,8.35 C27.1
N$2  (via drill 0.25 pad 0.66)
  Top 0.127: v39.94,15.39 40.47,14.98 40.47,14.04 40.32,13.86 34.71,13.86 34.45,14.13 PROC.6
  Bottom 0.127: v39.94,15.39 40.05,15.24 U5.1
N$3  (via drill 0.25 pad 0.66)
  Top 0.127: v24.34,4.76 24.34,4.97 24.34,5.01 LED3.C
  Bottom 0.127: v24.34,4.76 24.06,4.77 R12.1
N$4
  Top 0.254: Q2.1 0.8,12.05 R19.2 1.1,12.35 2.15,12.35 R18.2
N$6
  Top 0.127: PROC.29 26.5,7.14 LED3.A
N$7  (via drill 0.25 pad 0.66)
  Top 0.127: v22.44,7.05 22.58,7.19 LED2.C
  Bottom 0.127: v22.44,7.05 22.58,6.93 R14.1
N$8  (via drill 0.25 pad 0.66)
  Top 0.127: v23.43,9.19 23.79,8.85 LED1.C
  Bottom 0.127: v23.43,9.19 23.27,9.02 R15.1
N$9
  Top 0.127: PROC.28 25.98,7.64 LED2.A
N$11
  Top 0.127: LED1.A 25.55,8.14 26.52,8.14 PROC.27
N$14  (via drill 0.25 pad 0.66)
  Top 0.127: R1.2 6.88,8.25 6.73,8.25 5.66,6.94 5.12,6.93 4.87,6.98 v4.88,9.22 | Q1.1 5.26,6.71
  Top 0.254: Q1.1 5.12,6.8 5.12,6.93
  Bottom 0.254: v4.88,9.22 4.98,9.33 R2.2
N$15  (via drill 0.25 pad 0.66)
  Top 0.254: JP12.2 1,7.25 1.5,7.75 1.5,10.5 Q2.3 v1.75,11.45 | R22.2 3.65,16.1 v3.5,16.15
  Bottom 0.254: C30.2 2.65,15.55 D2.2 | D2.2 3.15,14.85 2.65,14.85 2.5,14.7 2.5,14.35 1.7,13.55 1.7,11.5 v1.75,11.45 | D2.2 3.5,15.2 v3.5,16.15
N$16  (via drill 0.25 pad 0.66)
  Top 0.127: v5.9,8.18 5.89,7.99
  Top 0.305: 5.89,7.99 Q1.3 | v6.02,6.3 5.67,6.3 4.58,6.29 4.33,5.96 4.33,4.75 4.67,4.53 JP6.2
  Bottom 0.127: 9.53,15.95 D1.2 | v5.9,8.18 5.99,8.03
  Bottom 0.254: v5.9,8.18 6.08,8.1 6.35,8.37 6.34,16.83 8.08,16.83 8.38,16.55 C11.2 9.53,15.95
  Bottom 0.305: 5.99,8.03 R13.2 | v6.02,6.3 6.03,7.11 5.92,7.38 v5.9,8.18
N$19
  Top 0.254: U7.1 6.23,11.68 6.95,12.4 6.95,12.81 7.51,13.36
  Top 0.305: JP7.1 4.35,15.9 4.35,17.88 4.59,18.24 7.22,18.24 7.5,17.88 7.51,13.36
N$20
  Top 0.305: JP7.2 4.41,14.9 4.41,10.44 4.62,10.18 U7.4
N$21
  Top 0.127: JP3.1 26.71,17.49 26.55,17.04 26.55,13.13 PROC.17
N$23  (via drill 0.25 pad 0.66)
  Top 0.127: v16.43,8.78 16.44,8.31 16.84,8.14 16.7,8.2 17.68,7.77 18.8,7.31 U4.29
  Bottom 0.127: v16.43,8.78 16.52,8.78 17.02,8.53 C4.1
N$24
  Top 0.127: PROC.18 26.27,12.64 26.23,12.9 26.23,16.92 25.88,17.23 JP3.2
N$25  (via drill 0.25 pad 0.66)
  Top 0.127: v9.28,10.5 9.1,10.68 | 9.1,10.68 | 9.1,10.68 U7.6 | v7.76,18.7 7.9,18.55 7.93,18.52 7.93,13.13 7.76,12.96 v7.76,12.46
  Bottom 0.254: v7.76,12.46 7.76,10.76 8.02,10.5 v9.28,10.5 | v7.76,18.7 5.27,18.7 4.92,18.3 4.92,14.3 R3.2
N$26  (via drill 0.25 pad 0.66)
  Top 0.127: v7.43,9.63 8.09,9.63 8.4,9.89 8.4,9.9 U7.5
  Bottom 0.127: 7.02,16.14 6.76,16.15 R4.2
  Bottom 0.254: 7.02,16.14 R3.1 6.98,10.88 v7.43,9.63
N$28  (via drill 0.25 pad 0.66)
  Top 0.127: U4.13 19.31,1.15 19.55,1.15 | 19.55,1.15 19.81,1.15 U4.14 | 19.55,1.15 19.55,0.89 19.55,0.74 21.54,0.74 24.05,0.75 v24.2,1.04
  Bottom 0.127: v24.2,1.04 23.43,1.05 21.53,1.05 19.58,3 19.34,2.99 C6.1
N$29  (via drill 0.25 pad 0.66)
  Top 0.127: v18.55,15.34 18.63,15.25 U3.20
  Bottom 0.127: v18.55,15.34 v18.54,15.33 C7.2
N$32  (via drill 0.25 pad 0.66)
  Top 0.127: v18.27,9.41 18.13,9.42 U3.10
  Bottom 0.127: v18.27,9.41 18.06,9.49 C9.1
N$42  (via drill 0.25 pad 0.66)
  Top 0.127: v39.91,14.4 39.78,14.12 35.45,14.12 PROC.4
  Bottom 0.127: v39.91,14.4 40.05,14.4 U5.2
N$43  (via drill 0.25 pad 0.66)
  Top 0.254: v13.08,5.36 12.89,5.27 BALUN.4
  Bottom 0.254: v13.08,5.36 13.79,4.87 13.79,4.42 C19.1
N$45  (via drill 0.25 pad 0.66)
  Top 0.127: v33.81,16.41 34.09,16.17 34.49,16.16 34.8,16.16 34.96,16.05 PROC.5
  Bottom 0.127: v33.81,16.41 32.9,16.41 32.68,16.22 32.66,16.2 32.66,16.21 U5.8
N$46  (via drill 0.25 pad 0.66)
  Top 0.254: v12.73,4.03 12.52,4.28 BALUN.3
  Bottom 0.254: v12.73,4.03 12.74,3.73 13,3.49 C20.1
N$47  (via drill 0.25 pad 0.66)
  Top 0.254: v15.65,5.31 15.92,4.55 U4.4
  Bottom 0.254: v15.65,5.31 15.07,5.29 15.03,5.19 C19.2
N$48  (via drill 0.25 pad 0.66)
  Top 0.127: v35.38,10.97 33.71,11.04 33.45,11.31 PROC.8
  Bottom 0.127: v35.38,10.97 38.42,10.97 38.75,11.25 U5.4
N$49  (via drill 0.25 pad 0.66)
  Top 0.254: v15.7,3.23 15.7,3.72 16.1,4 U4.5
  Bottom 0.254: v15.7,3.23 14.79,3.23 C20.2
N$50  (via drill 0.25 pad 0.66)
  Top 0.127: 21.43,9.67 21.43,7.43 21.14,7.15 U4.25 | 21.43,9.67 22.13,9.2 U10.3 | 21.43,9.67 v20.61,10.24
  Bottom 0.127: v20.61,10.24 20.63,10.02 20.63,9.62 C22.1
N$51  (via drill 0.25 pad 0.66)
  Top 0.127: U4.26 20.31,7.56 20.41,7.76 20.25,7.83 v19.66,8.46 20.31,7.78 U10.1
  Bottom 0.127: v19.66,8.46 20.19,7.86 C21.1
N$52
  Top 0.254: 11.2,4.55 11.21,4.55
  Top 0.406: 11.2,4.55 11.2,4.3 U11.P$1 11.84,3.2 12.65,2.55 12.7,2.45 U12.SIG | 11.21,4.55 BALUN.1
N$57  (via drill 0.25 pad 0.66)
  Top 0.127: v43.28,1.04 43.28,0.51 43.02,0.25 | 43.02,0.25 | 43.02,0.25 37.21,0.25 36.94,0.51 JP4.1
  Bottom 0.127: C13.1 36.11,0.77 37.83,0.77 | v43.28,1.04 43.01,0.77 37.83,0.77 | 37.83,0.77 R10.1
N$62
  Top 0.127: PROC.21 28.55,11.14 28.82,11.41 28.81,13.98 28.2,14.74 28.2,16.18 27.92,16.46 27.92,17.08 27.4,17.66 27.4,19.36 27.32,19.48 21.88,19.48 21.85,19.45 21.85,19.2 | 21.87,19.2 21.86,19.2 21.85,19.2 | 21.85,18.6 21.85,18.51 JP3.6 | 21.85,19.2 21.85,18.6 | 21.85,18.6 21.9,18.55 21.9,19.15 21.85,19.2
OSC1  (via drill 0.25 pad 0.66)
  Top 0.127: v44.52,19.35 44.44,19.35 44.21,19.58 44.01,19.72 41.44,19.72 40.81,19.17 U6.3 | v43.46,1.93 42.7,1.93 42.44,1.67 42.44,0.52 37.94,0.52 JP4.2 | v32.21,1.51 32.45,1.74 PROC.39 | v43.22,5.42 43.22,5.87 43.25,5.9 43.55,6.21 43.55,9.55 43.19,9.83 JP2.12
  Bottom 0.127: v44.52,19.35 44.52,5.78 44.33,5.59 44.33,5.42 | 44.33,5.42 44.33,2.23 44.08,1.94 44.07,1.93 v43.46,1.93 44.04,1.39 44.04,0.78 44.01,0.75 43.8,0.51 33.13,0.51 v32.21,1.51 | 44.33,5.42 v43.22,5.42
OSC2
  Top 0.127: PROC.40 32.93,1.27 32.63,0.98 27.96,0.98 JP9.2
PWM1  (via drill 0.25 pad 0.66)
  Top 0.127: R1.1 10.47,8.44 10.75,8.65 JP5.4 v13.95,8.65 v13.95,8.66 | v29.64,12.34 29.64,11.95 29.98,11.61 31.05,10.25 31.4,10.23 31.82,9.78 36.18,9.78 36.43,10.25 36.43,10.88 36.69,11.14 PROC.60
  Bottom 0.127: v29.64,12.34 29.15,12.77 29.12,14.42 22.29,14.42 22.03,14.21 22.03,11.9 21.77,11.64 19.58,11.64 19.32,11.38 19.32,10.66 18.86,10.22 18.86,9.23 18.6,8.88 17.66,8.88 17.19,9.3 15.83,9.3 15.66,9.54 14.84,9.54 v13.95,8.66
PWM1H  (via drill 0.25 pad 0.66)
  Top 0.127: PROC.61 39.89,11.61 v40.52,11.86 | v37.41,16.71 37.41,17.02 37.4,18.04 37.4,17.87 JP10.9
  Bottom 0.127: v40.52,11.86 41.09,12.35 41.07,13.53 40.9,13.64 40.9,15.87 39.98,16.57 38.09,16.58 37.96,16.71 v37.41,16.71
PWM2  (via drill 0.25 pad 0.66)
  Top 0.127: 10.33,10.83 9.98,11.18 U7.7 | 10.33,10.83 10.51,10.65 JP5.2 13.03,10.65 v13.37,10.55 | v31.09,11.14 32.11,10.1 35.91,10.1 36.17,10.51 36.17,11.88 36.43,12.14 PROC.62 | 10.33,10.83 9.35,9.8 8.8,9.8 8.2,9.25 8.05,9.25 7.9,9.1 7.2,9.1 6.46,9.82 4.22,9.82 3.85,10.2 3.85,12.15 3.75,12.25 3.8,12.3 R18.1 3.7,12.3
  Top 0.254: JP11.4 2.2,16.5 3,15.7 3,14.4 3.45,13.95 R18.1
  Bottom 0.127: v31.09,11.14 30.44,11.92 30.44,12.96 30.43,12.97 30.43,12.98 29.89,13.52 29.72,13.51 29.69,13.53 29.69,14.97 29.67,14.98 20.06,14.98 19.48,15.87 17.63,15.87 16.83,15.06 15.46,15.06 15.37,14.8 15.37,10.91 14.93,10.65 | 14.93,10.65 | v13.37,10.55 14.93,10.65
PWM2H  (via drill 0.25 pad 0.66)
  Top 0.127: PROC.63 40.1,12.63 v40.54,12.86 | v36.6,16.66 36.35,16.91 JP10.8
  Bottom 0.127: v40.54,12.86 40.54,14.39 40.54,15.53 40.52,15.67 40.27,15.93 39.73,16.29 38.01,16.29 37.85,16.18 37.09,16.18 36.91,16.46 v36.6,16.66
PWM3  (via drill 0.25 pad 0.66)
  Top 0.127: v42.99,18.78 42.98,18.49 42.99,17.31 42.76,17.01 42.31,17.02 41.54,17.02 41.35,16.74 41.34,16.53 41.08,16.26 41.08,14.16 40.06,13.14 PROC.64 | JP5.1 10.43,11.65 10.26,11.82 v9.73,11.82 9.15,11.82 9.01,11.68 U7.8
  Bottom 0.127: v9.73,11.82 10.63,11.82 10.8,12.08 10.8,19.29 11.3,19.69 42.75,19.71 43,19.5 42.99,19.49 v42.99,18.78
PWM3H
  Top 0.127: PROC.1 37.65,15.2 38.13,15.2 39,15.19 39.29,15.67 39.29,16.46 39.69,16.84 39.93,17.08 39.94,17.6 39.95,19.47 39.73,19.77 29.3,19.77 29.3,18.58 JP10.1
PWM4
  Top 0.127: JP10.7 35.35,17.34 35.9,16.8 35.9,16.5 36.5,15.9 36.5,15.8 36.45,15.75 PROC.2
PWM4H
  Top 0.127: PROC.3 35.95,16.05 35.82,16.18 35.46,16.53 34.96,17.06 34.4,17.71 JP10.6
RB15  (via drill 0.25 pad 0.66)
  Top 0.127: v28.88,6.27 28.49,6.64 PROC.30 | v16.71,1.09 18.3,1.09 U4.11
  Bottom 0.127: v16.71,1.09 17.44,0.51 28.61,0.51 29.8,0.52 29.98,0.71 29.95,3.75 29.39,4.31 29.39,4.73 28.8,5.25 28.81,5.72 28.89,5.8 v28.88,6.27
RC13  (via drill 0.25 pad 0.66)
  Top 0.127: v36.45,6.92 | PROC.47 v36.45,6.92 | v40.44,10.91 40.8,11.31 40.98,11.31 41.16,11.48 41.16,11.73 41.41,11.99 41.41,12.5 41.6,12.77 JP2.18
  Bottom 0.127: v40.44,10.91 40.28,10.62 40.28,10.13 40.12,9.9 39.73,9.38 36.71,9.36 36.45,9.1 v36.45,6.92
RC14  (via drill 0.25 pad 0.66)
  Top 0.127: v38.18,3.94 38.17,3.94 37.94,3.58 36.97,3.58 PROC.48 | v43.29,3.26 43.55,3.52 43.98,3.52 44.24,3.78 44.32,3.86 44.32,12.14 43.98,12.33 JP2.17
  Bottom 0.127: v43.29,3.26 43.72,3.69 43.72,4.32 43.46,4.58 38.82,4.58 v38.18,3.94
RD0  (via drill 0.25 pad 0.66)
  Top 0.127: v42.73,2.7 42.66,2.77 42.66,6.83 JP2.6 | v35.91,5.43 35.95,5.41 PROC.46
  Bottom 0.127: v35.91,5.43 38.57,5.43 39.12,4.88 | 39.12,4.88 | 39.12,4.88 43.72,4.88 43.98,4.62 | 43.98,4.62 | 43.98,4.62 43.98,2.96 43.72,2.7 v42.73,2.7
RD1
  Top 0.127: PROC.49 40.36,5.64 40.54,5.83 JP2.4
RD2
  Top 0.127: PROC.50 38.05,6.14 38.05,5.33 38.3,5.2 38.31,5.2 39.8,5.2 40.06,5.33 JP2.3
RD3
  Top 0.127: PROC.51 40.3,6.64 40.62,6.33 JP2.5
RD4
  Top 0.127: JP2.7 41.08,7.33 40.9,7.14 PROC.52
RD5
  Top 0.127: JP2.9 41.58,8.31 40.93,7.64 PROC.53
RD6
  Top 0.127: JP2.11 41.68,9.3 41.39,9 41.39,8.71 40.89,8.15 PROC.54
RD7
  Top 0.127: JP2.13 41.64,10.32 41.47,10.15 41.47,9.7 40.76,8.64 PROC.55
RF0
  Top 0.127: PROC.58 40.7,10.14 41.44,11.14 41.44,11.57 41.44,11.64 41.54,11.73 JP2.16
RF1  (via drill 0.25 pad 0.66)
  Top 0.127: v35.91,8.57 36.69,9.34 36.69,10.38 36.95,10.64 PROC.59 | v43.01,7.83 42.93,7.83 JP2.8
  Bottom 0.127: v43.01,7.83 43.02,6.59 42.67,6.23 36.18,6.23 35.91,6.49 | 35.91,6.49 | 35.91,6.49 v35.91,8.57
SCK1
  Top 0.127: U4.19 22.3,3.4 23.12,2.81 26.59,2.81 27.1,3.43 28.56,3.43 28.81,3.18 28.81,2.54 29.05,2.39 30.14,2.39 30.17,2.42 30.45,2.65 PROC.35
SCL1  (via drill 0.25 pad 0.66)
  Top 0.127: v34.69,6.4 34.65,6.44 31.71,6.44 31.45,6.17 PROC.37 | v43.99,14.12 43.58,14.13 43.35,13.83 JP2.20 | v25.3,9.38 25.04,9.38 23.85,10.3 U8.14 | v29.72,9.24 32.88,9.24 33.2,8.92 v34.7,8.92
  Bottom 0.127: v34.69,6.4 34.69,5.7 34.95,5.43 35.3,5.43 35.3,3.33 R5.1 | v34.69,6.4 35.23,6.4 35.66,5.97 43.73,5.97 43.99,6.23 v43.99,14.12 | v25.3,9.38 28.23,9.38 29.49,9.37 v29.72,9.24 | v34.7,8.92 v34.69,6.4
SCL2  (via drill 0.25 pad 0.66)
  Top 0.127: v14.69,7.42 14.69,11.98 14.48,12.27 14.14,12.73 13.61,12.73 13.25,12.73 11.15,12.73 10.8,12.91 10.8,13.89 11.15,14.15 14.27,14.15 15.1,14.97 17.13,14.97 U3.23 | v28.71,7.5 29.02,7.5 29.31,7.8 30.49,7.8 30.76,8.07 32.26,8.07 32.45,8.19 33.52,8.19 33.54,8.18 v33.66,8.03 | v26.13,6.19 26.13,5.91 26.52,5.64 PROC.32 | v39.23,2.88 39.94,2.88 JP4.4
  Bottom 0.127: v14.69,7.42 15.19,6.9 20.69,6.9 21.1,6.59 21.11,3.76 22.11,2.92 25.21,2.92 25.45,3.26 25.44,4.5 25.8,4.9 25.81,5.32 26.12,5.63 v26.13,6.19 26.13,6.42 26.72,6.89 27.4,7.5 v28.71,7.5 | v14.69,7.42 | 34.78,3.87 35.04,4.13 35.04,5.17 33.92,5.17 33.66,5.43 v33.66,8.03 | 34.78,3.87 31.19,3.87 R8.1 | 34.78,3.87 35.04,3.87 35.04,3.04 35.3,2.78 | 35.3,2.78 | 35.3,2.78 39.13,2.78 v39.23,2.88
SDA1  (via drill 0.25 pad 0.66)
  Top 0.127: v44.86,5.14 44.86,14.56 44.6,14.83 JP2.22 | PROC.36 30.95,2.42 30.95,2.29 v30.95,2.12 28.93,2.13 28.52,2.43 28.52,2.66 v28.21,2.89 | v26.34,4.25 25.84,4.61 25.12,5.3 24.71,5.3 24.42,5.5 24.42,6.52 24.55,6.65 24.53,9.09 23.57,9.87 22.71,9.87 21.95,10.53 21.95,11.01 U8.13
  Bottom 0.127: v44.86,5.14 44.86,0.51 44.6,0.25 32.56,0.25 31.15,1.55 30.94,1.76 v30.95,2.12 31.58,2.12 31.46,2.12 34.13,2.12 34.4,2.43 R6.1 | v28.21,2.89 28.23,4.59 27.91,5.05 27.25,5.05 26.69,4.25 v26.34,4.25
SDA2  (via drill 0.25 pad 0.66)
  Top 0.127: JP4.3 38.71,1.62 38.71,4.27 38.53,4.47 37.33,4.47 36.98,4.8 36.98,7.2 36.73,7.47 33.48,7.47 33.37,7.54 29.93,7.54 29.6,7.02 29.59,5.82 v29.39,5.56 28.69,5.56 28.44,5.82 28.12,6.14 PROC.31 | v11.35,13.35 13.88,13.35 14.94,14.43 U3.24
  Bottom 0.127: 30.36,2.65 30.36,0.61 30.2,0.25 16.86,0.26 16.07,0.81 16.07,1.65 15.91,1.86 15.91,2.51 15.73,2.61 14.48,2.62 14.25,2.85 14.25,3.85 14.4,4.1 14.4,5.3 11.32,7.01 11.28,12.63 11.42,12.77 v11.35,13.35 | 30.36,2.65 32.49,2.65 R7.1 | v29.39,5.56 29.65,5.26 29.65,4.55 30.35,3.95 30.36,2.65
SDI1
  Top 0.127: PROC.34 29.96,2.75 29.82,2.65 29.24,2.65 29.09,2.74 29.09,3.53 28.86,3.69 26.96,3.69 26.47,3.08 23.23,3.08 22.2,3.9 22.04,4 U4.20
SDO1
  Top 0.127: PROC.33 29.4,3.89 29.38,3.98 28.52,3.98 26.86,3.98 26.3,3.37 24.13,3.37 23.8,3.71 23.8,4.1 22.9,5 U4.22
SS1  (via drill 0.25 pad 0.66)
  Top 0.127: v24.38,3.94 24.36,3.94 24.16,4.14 23.69,4.62 22.99,5.42 21.89,5.42 21.56,5.42 U4.23 | v28.69,10.55 28.82,10.66 29.08,10.84 29.08,12.84 30.44,14.2 PROC.14
  Bottom 0.127: v28.69,10.55 27.24,10.55 26.72,9.9 24.97,9.92 24.71,9.66 24.71,9.19 25.25,8.65 25.26,5.11 24.88,4.73 24.87,4.31 v24.38,3.94
VCC  (via drill 0.25 pad 0.66)
  Top 0.178: v21.13,16.55 21.12,17.09 21.22,17.22 21.22,19.47 18.15,19.47 17.91,19.24 U2.6 | v40.7,9.55 41.46,10.7 JP2.14 | v42.8,16.46 42.87,16.57 42.78,16.6 42.2,16.61 v41.91,16.48 41.75,16.39 41.41,16.05 41.39,14.52 41.56,14.34 JP2.21
  Bottom 0.178: C17.1 17.2,16.96 17.55,16.57 21.05,16.56 v21.13,16.55 23.61,17.23 24.13,17.66 32.18,17.64 32.48,17.64 32.61,17.71 35.92,17.69 40.96,17.72 40.96,17.76 41.4,18.12 42.32,18.11 v42.8,16.46 | v40.7,9.55 40.9,9.19 41.66,9.19 42.05,9.58 C1.2 41.26,13.95 41.28,15.93 41.75,16.39 v41.91,16.48
VDD  (via drill 0.25 pad 0.66)
  Top 0.254: v15.8,10.18 15.8,9.61 16.21,9.61 17.13,9.61 17.13,8.8 | 17.13,8.8 17.13,9.87 U3.8 | v23.71,16.17 23.12,16.17 22.52,15.68 21.79,15.68 20.8,14.73 20.8,13.17 20.7,13.05 v20.7,12.43 20.7,11.44 20.44,11.18 U3.13 | v29.44,1.53 30.56,1.52 30.85,1.32 31.19,1.32 31.95,2.22 PROC.38 | U8.1 25.91,11.01 25.91,8.9 26.18,8.64 PROC.26 28.2,8.65 28.67,8.14 30.2,8.14 30.79,8.62 v32.07,8.62 | v31.54,13.06 32.45,13.11 PROC.10 | U4.28 19.31,7.5 17.71,8.17 17.49,8.27 17.13,8.47 17.13,8.8 | PROC.19 28.46,12.14 28.45,13.39 v28.18,13.85 27.77,14.57 27.75,16.02 v27.29,16.94 | v24.54,1.78 24.49,1.76 23.85,1.76 23.5,1.07 21.22,1.08 20.31,1.08 U4.15 | JP4.6 41.87,1.62 41.87,3.35 v41.8,3.41 41.53,3.41 41.33,3.61 v40.1,3.61 40.09,4.54 39.82,4.83 37.63,4.83 37.38,5.07 37.38,7.5 36.89,7.99 36.89,8.8 v37.79,9.94 38.16,9.65 PROC.57 | v23.71,16.17 23.78,16.1 23.78,15.11 U8.7 | v16.62,1.87 16.58,1.99 U4.8 | v38.16,18.26 38.15,18.27 U6.4 | v23.71,16.17 23.88,16.54 JP3.4 | v14.88,16.06 15.01,16.07 15.01,17.02 15.27,17.28 U1.6 | v27.92,18.24 27.92,17.63 28.4,17.15 28.4,16.85 28.65,16.6 28.65,16.09 v28.75,15.99
  Bottom 0.127: 12.62,10.9 12.65,10.95 | v15.8,10.18
  Bottom 0.254: 19.94,5.7 20.17,5.41 20.17,2.98 21.43,1.77 v24.54,1.78 25.13,1.13 25.51,1.14 28.88,1.14 29.2,1.33 v29.44,1.53 29.45,3.59 29.05,4.05 29.04,4.47 28.41,5.03 28.41,5.29 28.21,5.45 28.21,6.45 28.54,6.88 29.27,6.89 30,5.95 30.01,4.8 30.19,4.54 R8.2 R7.2 33.13,4.54 33.13,4.62 33.39,4.88 | 19.94,5.7 17.98,5.68 C5.1 17.34,3.8 17.34,2.26 17.06,2.01 16.82,1.88 v16.62,1.87 | 19.94,5.7 C3.1 | 33.39,4.88 33.65,4.63 R6.2 | v37.79,9.94 37.22,9.93 35.06,9.93 34.58,9.94 34.58,10.73 34.59,10.99 34.57,11.05 33.42,11.06 32.92,12.14 32.95,12.14 U5.5 31.61,12.15 v31.54,13.06 | 12.65,10.95 12.73,11.18 14.67,11.18 15.02,11.43 15.03,15.31 14.88,15.46 v14.88,16.06 13.8,16.06 13.63,16.25 13.64,17.43 13.53,17.54 C25.1 | 12.62,10.9 12.62,10.39 12.61,9.9 15.63,9.9 v15.8,10.18 16.24,9.64 17.38,9.64 17.39,10.77 17.53,11.1 18.53,11.1 C10.1 18.57,11.73 18.6,11.76 C8.1 20.18,12.96 v20.7,12.43 | R5.2 36.73,4.63 37.7,3.21 38.43,3.21 38.81,3.59 v40.1,3.61 40.09,1.8 39.82,1.53 R10.2 | v28.18,13.85 28.17,12.51 C14.1 24.28,12.3 24.33,12.53 28.12,12.52 29.8,10.95 29.79,10.95 29.81,10.94 32.08,8.95 v32.07,8.62 | v37.79,9.94 39.53,9.94 39.82,10.28 39.8,12.72 U5.3 | v31.54,13.06 31.35,13.1 31.15,13.3 30.62,14.08 30.65,16.94 30.6,16.96 v28.75,15.99 v27.29,16.94 24.5,16.96 v23.71,16.17 | v41.8,3.41 41.8,2.58 42.21,2.17 C18.1 | v31.54,13.06 31.65,13.14 32.95,13.14 U5.6 | 33.39,4.88 33.13,5.14 33.14,6.8 33.15,7.23 32.98,7.59 32.98,8.42 R9.2 34.57,9.92 35.14,9.93 35.41,9.93 v37.79,9.94 | 33.39,4.88 | C23.1 34.61,18.25 v38.16,18.26 37.78,18.25 v27.92,18.24
VEE  (via drill 0.25 pad 0.66)
  Top 0.178: v43.46,11.33 JP2.15 | v20.53,18.48 19.86,19.16 18.41,19.16 U2.5
  Bottom 0.178: C16.1 18.43,16.9 20.53,16.91 21.23,17.22 21.22,17.88 v20.53,18.48 24.4,18.48 24.72,18.8 37.44,18.82 41.4,18.83 41.81,18.47 41.88,18.44 42.42,18.45 42.84,18.1 44.01,18.09 44.14,17.92 44.16,17.76 44.16,15.25 43.39,14.53 43.39,13.79 43.6,13.59 43.6,12.69 43.46,12.49 v43.46,11.33
VPP  (via drill 0.25 pad 0.66)
  Top 0.178: JP8.2 13.33,14.91 13.59,15.18 13.59,15.98 v14.37,16.87 14.38,17.38 14.83,17.77 15.99,17.78 U1.5 | v25.21,15.79 25.15,15.72 25.15,15.01 U8.6 | v27.14,15.79 v27.17,13.86
  Bottom 0.178: 15.13,16.87 15.84,16.2 20.51,16.21 21.48,15.56 24.11,15.57 24.38,15.79 v25.21,15.79 v27.14,15.79 | v14.37,16.87 15.13,16.87 | 15.13,16.87 C26.1 | C29.2 23.63,10.93 23.67,13.6 C28.1 26.53,13.58 v27.17,13.86

### Text on the board
tPlace: PROG | OB | AN0 | GND | BAT+ | AN8 | MCLR | VDD | GND | AN7 | AN6 | AN0 | AN1 | AN3 | AN4 | AN5 | P4H | P4L | P2H | P1H | OA | VPP | PWM3L | PWM2L | BAT+ | PWM1L | AN11 | MOT+ | GND | MOT- | MOT+ | MOT- | AN10 | OSC2 | OSC1 | SDA2 | SCL2 | GND | VDD
bPlace: UC Berkeley | ImageProc 2.4 AP
tNames: U2 | U1
bDocu: GYRO | XL | RADIO | LED | I2C2 | I2C1 | WII